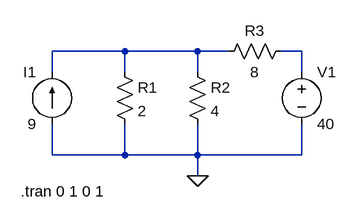
[diagram p0: schematic Circuit_4.asc]
Circuit_4.asc, the LTspice schematic file:
Version 4.1
SHEET 1 880 680
WIRE 144 112 32 112
WIRE 256 112 144 112
WIRE 304 112 256 112
WIRE 416 112 384 112
WIRE 32 144 32 112
WIRE 144 144 144 112
WIRE 256 144 256 112
WIRE 416 144 416 112
WIRE 32 272 32 224
WIRE 144 272 144 224
WIRE 144 272 32 272
WIRE 256 272 256 224
WIRE 256 272 144 272
WIRE 416 272 416 224
WIRE 416 272 256 272
WIRE 256 304 256 272
FLAG 256 304 0
SYMBOL voltage 416 128 R0
WINDOW 123 0 0 Left 0
WINDOW 39 0 0 Left 0
SYMATTR InstName V1
SYMATTR Value 40
SYMBOL current 32 224 R180
WINDOW 0 24 80 Left 2
WINDOW 3 24 0 Left 2
WINDOW 123 0 0 Left 0
WINDOW 39 0 0 Left 0
SYMATTR InstName I1
SYMATTR Value 9
SYMBOL res 128 128 R0
SYMATTR InstName R1
SYMATTR Value 2
SYMBOL res 240 128 R0
SYMATTR InstName R2
SYMATTR Value 4
SYMBOL res 400 96 R90
WINDOW 0 0 56 VBottom 2
WINDOW 3 32 56 VTop 2
SYMATTR InstName R3
SYMATTR Value 8
TEXT -16 328 Left 2 !.tran 0 1 0 1

The netlist it stands for:
* Circuit_4.asc
V1 N002 0 40
I1 0 N001 9
R1 N001 0 2
R2 N001 0 4
R3 N002 N001 8
.tran 0 1 0 1
.backanno
.end